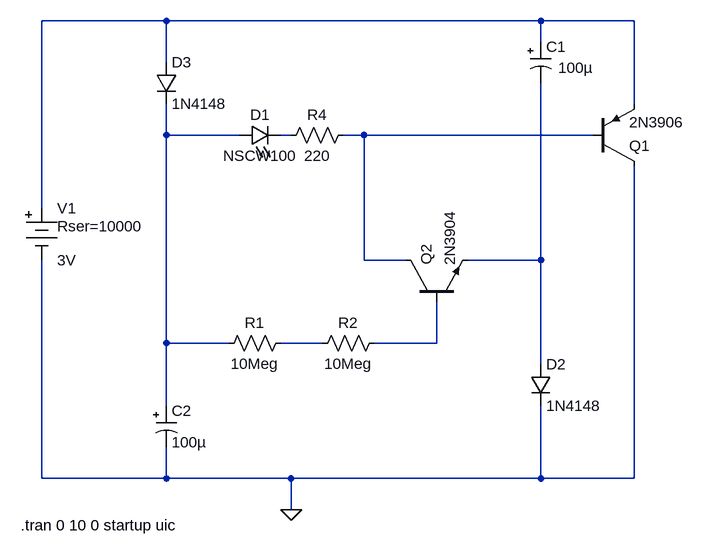
[diagram p0: schematic havener.asc]
havener.asc, the LTspice schematic file:
Version 4
SHEET 1 880 680
WIRE -288 -400 -480 -400
WIRE 288 -400 -288 -400
WIRE 432 -400 288 -400
WIRE 288 -368 288 -400
WIRE -288 -336 -288 -400
WIRE 432 -272 432 -400
WIRE -288 -224 -288 -272
WIRE -176 -224 -288 -224
WIRE -96 -224 -112 -224
WIRE 16 -224 -16 -224
WIRE 368 -224 16 -224
WIRE -480 -112 -480 -400
WIRE 16 -32 16 -224
WIRE 80 -32 16 -32
WIRE 288 -32 288 -304
WIRE 288 -32 176 -32
WIRE -288 96 -288 -224
WIRE -192 96 -288 96
WIRE -48 96 -112 96
WIRE 128 96 128 32
WIRE 128 96 32 96
WIRE 288 128 288 -32
WIRE -288 192 -288 96
WIRE -480 304 -480 -32
WIRE -288 304 -288 256
WIRE -288 304 -480 304
WIRE -96 304 -288 304
WIRE 288 304 288 192
WIRE 288 304 -96 304
WIRE 432 304 432 -176
WIRE 432 304 288 304
WIRE -96 352 -96 304
FLAG -96 352 0
SYMBOL pnp 368 -176 M180
SYMATTR InstName Q1
SYMATTR Value 2N3906
SYMBOL npn 80 32 R270
SYMATTR InstName Q2
SYMATTR Value 2N3904
SYMBOL diode 272 128 R0
SYMATTR InstName D2
SYMATTR Value 1N4148
SYMBOL diode -304 -336 R0
SYMATTR InstName D3
SYMATTR Value 1N4148
SYMBOL polcap 272 -368 R0
WINDOW 3 43 40 Left 2
SYMATTR Value 100µ
SYMATTR InstName C1
SYMATTR SpiceLine V=2.5 Irms=3.72678 Rser=0.018 Lser=0 mfg="KEMET" pn="A700D107M2R5ATE018" type="Al electrolytic"
SYMATTR Description Capacitor
SYMATTR Type cap
SYMBOL polcap -304 192 R0
WINDOW 3 24 56 Left 2
SYMATTR InstName C2
SYMATTR Value 100µ
SYMATTR SpiceLine V=2.5 Irms=2.98807 Rser=0.028 Lser=0 mfg="KEMET" pn="A700D107M2R5ATE028" type="Al electrolytic"
SYMATTR Description Capacitor
SYMATTR Type cap
SYMBOL res 0 -240 R90
WINDOW 0 0 56 VBottom 2
WINDOW 3 32 56 VTop 2
SYMATTR InstName R4
SYMATTR Value 220
SYMBOL res -96 80 R90
WINDOW 0 0 56 VBottom 2
WINDOW 3 32 56 VTop 2
SYMATTR InstName R1
SYMATTR Value 10Meg
SYMBOL Misc\\battery -480 -128 R0
WINDOW 123 0 0 Left 0
WINDOW 39 24 44 Left 2
SYMATTR InstName V1
SYMATTR Value 3V
SYMATTR SpiceLine Rser=10000
SYMBOL LED -176 -208 R270
WINDOW 0 32 32 VTop 2
WINDOW 3 0 32 VBottom 2
SYMATTR InstName D1
SYMATTR Value NSCW100
SYMATTR Description Diode
SYMATTR Type diode
SYMBOL res 48 80 R90
WINDOW 0 0 56 VBottom 2
WINDOW 3 32 56 VTop 2
SYMATTR InstName R2
SYMATTR Value 10Meg
TEXT -512 376 Left 2 !.tran 0 10 0 startup uic

The netlist it stands for:
* havener.asc
Q1 0 N004 N001 0 2N3906
Q2 N004 N007 N005 0 2N3904
D2 N005 0 1N4148
D3 N001 N002 1N4148
C1 N001 N005 100µ V=2.5 Irms=3.72678 Rser=0.018 Lser=0 mfg="KEMET" pn="A700D107M2R5ATE018" type="Al electrolytic"
C2 N002 0 100µ V=2.5 Irms=2.98807 Rser=0.028 Lser=0 mfg="KEMET" pn="A700D107M2R5ATE028" type="Al electrolytic"
R4 N004 N003 220
R1 N006 N002 10Meg
V1 N001 0 3V Rser=10000
D1 N002 N003 NSCW100
R2 N007 N006 10Meg
.model D D
.lib standard.dio
.model NPN NPN
.model PNP PNP
.lib standard.bjt
.tran 0 10 0 startup uic
.backanno
.end